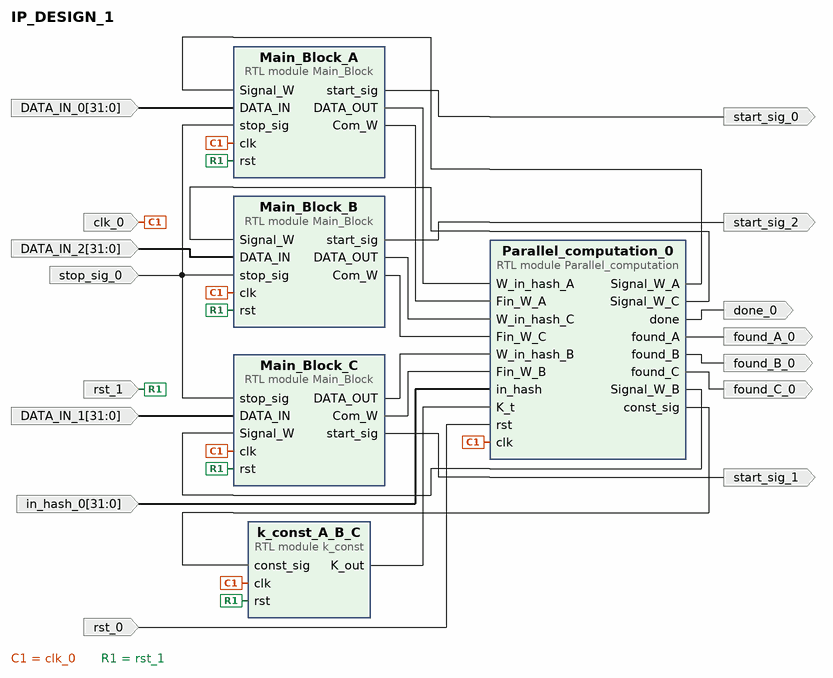
[diagram p0: block diagram of the top level]
# Vivado block design IP_DESIGN_1, xc7z020clg400-1, Vivado 2017.3
create_bd_design IP_DESIGN_1

create_bd_port -dir I -from 31 -to 0 DATA_IN_0
create_bd_port -dir I -type clk clk_0
create_bd_port -dir O start_sig_0
create_bd_port -dir I stop_sig_0
create_bd_port -dir I -from 31 -to 0 DATA_IN_1
create_bd_port -dir O start_sig_1
create_bd_port -dir I -from 31 -to 0 DATA_IN_2
create_bd_port -dir O start_sig_2
create_bd_port -dir O done_0
create_bd_port -dir O found_A_0
create_bd_port -dir O found_B_0
create_bd_port -dir O found_C_0
create_bd_port -dir I -from 31 -to 0 in_hash_0
create_bd_port -dir I -type rst rst_0
create_bd_port -dir I -type rst rst_1

create_bd_cell -type module -reference k_const k_const_A_B_C
create_bd_cell -type module -reference Parallel_computation Parallel_computation_0
create_bd_cell -type module -reference Main_Block Main_Block_A
create_bd_cell -type module -reference Main_Block Main_Block_B
create_bd_cell -type module -reference Main_Block Main_Block_C

# ---- connections ----

connect_bd_net -net Main_Block_0_DATA_OUT [get_bd_pins Main_Block_A/DATA_OUT] [get_bd_pins Parallel_computation_0/W_in_hash_A]
connect_bd_net -net Main_Block_2_DATA_OUT [get_bd_pins Main_Block_C/DATA_OUT] [get_bd_pins Parallel_computation_0/W_in_hash_B]
connect_bd_net -net Main_Block_1_DATA_OUT [get_bd_pins Main_Block_B/DATA_OUT] [get_bd_pins Parallel_computation_0/W_in_hash_C]
connect_bd_net [get_bd_pins Parallel_computation_0/Signal_W_A] [get_bd_pins Main_Block_A/Signal_W]
connect_bd_net [get_bd_pins Parallel_computation_0/Signal_W_B] [get_bd_pins Main_Block_C/Signal_W]
connect_bd_net [get_bd_pins Parallel_computation_0/Signal_W_C] [get_bd_pins Main_Block_B/Signal_W]
connect_bd_net -net Main_Block_1_Com_W [get_bd_pins Main_Block_B/Com_W] [get_bd_pins Parallel_computation_0/Fin_W_C]
connect_bd_net -net Main_Block_2_Com_W [get_bd_pins Main_Block_C/Com_W] [get_bd_pins Parallel_computation_0/Fin_W_B]
connect_bd_net -net Main_Block_0_Com_W [get_bd_pins Main_Block_A/Com_W] [get_bd_pins Parallel_computation_0/Fin_W_A]
connect_bd_net [get_bd_pins Parallel_computation_0/const_sig] [get_bd_pins k_const_A_B_C/const_sig]
connect_bd_net -net DATA_IN_0_1 [get_bd_ports DATA_IN_0] [get_bd_pins Main_Block_A/DATA_IN]
connect_bd_net -net clk_0_1 [get_bd_ports clk_0] \
  [get_bd_pins k_const_A_B_C/clk] [get_bd_pins Parallel_computation_0/clk] [get_bd_pins Main_Block_A/clk] \
  [get_bd_pins Main_Block_B/clk] [get_bd_pins Main_Block_C/clk]
connect_bd_net -net Main_Block_0_start_sig [get_bd_pins Main_Block_A/start_sig] [get_bd_ports start_sig_0]
connect_bd_net -net stop_sig_0_1 [get_bd_ports stop_sig_0] \
  [get_bd_pins Main_Block_A/stop_sig] [get_bd_pins Main_Block_B/stop_sig] [get_bd_pins Main_Block_C/stop_sig]
connect_bd_net -net DATA_IN_1_1 [get_bd_ports DATA_IN_1] [get_bd_pins Main_Block_C/DATA_IN]
connect_bd_net -net Main_Block_2_start_sig [get_bd_pins Main_Block_C/start_sig] [get_bd_ports start_sig_1]
connect_bd_net -net DATA_IN_2_1 [get_bd_ports DATA_IN_2] [get_bd_pins Main_Block_B/DATA_IN]
connect_bd_net -net Main_Block_1_start_sig [get_bd_pins Main_Block_B/start_sig] [get_bd_ports start_sig_2]
connect_bd_net [get_bd_pins Parallel_computation_0/done] [get_bd_ports done_0]
connect_bd_net [get_bd_pins Parallel_computation_0/found_A] [get_bd_ports found_A_0]
connect_bd_net [get_bd_pins Parallel_computation_0/found_B] [get_bd_ports found_B_0]
connect_bd_net [get_bd_pins Parallel_computation_0/found_C] [get_bd_ports found_C_0]
connect_bd_net -net in_hash_0_1 [get_bd_ports in_hash_0] [get_bd_pins Parallel_computation_0/in_hash]
connect_bd_net -net rst_0_1 [get_bd_ports rst_0] [get_bd_pins Parallel_computation_0/rst]
connect_bd_net -net rst_1_1 [get_bd_ports rst_1] \
  [get_bd_pins k_const_A_B_C/rst] [get_bd_pins Main_Block_A/rst] [get_bd_pins Main_Block_B/rst] \
  [get_bd_pins Main_Block_C/rst]
connect_bd_net -net k_const_0_K_out [get_bd_pins k_const_A_B_C/K_out] [get_bd_pins Parallel_computation_0/K_t]

validate_bd_design
save_bd_design
